# Altium schematic sheet LPCB225 - CONTROLLER.SchDoc
size A3; Address1: Factory 10; Address2: 9-13 Dingley Avenue, Dandeong, VICTORIA 3175, AUSTRALIA; DocumentNumber: 3; Revision: 1; SheetNumber: 3; SheetTotal: 6; Lockie__PCB_SUB_ASSEMBLY: Main Controller; Lockie__PCB_ASSEMBLY: Module; Lockie__LDL: LPCB225; Lockie__PCB_DESCRIPTION: BMS Module
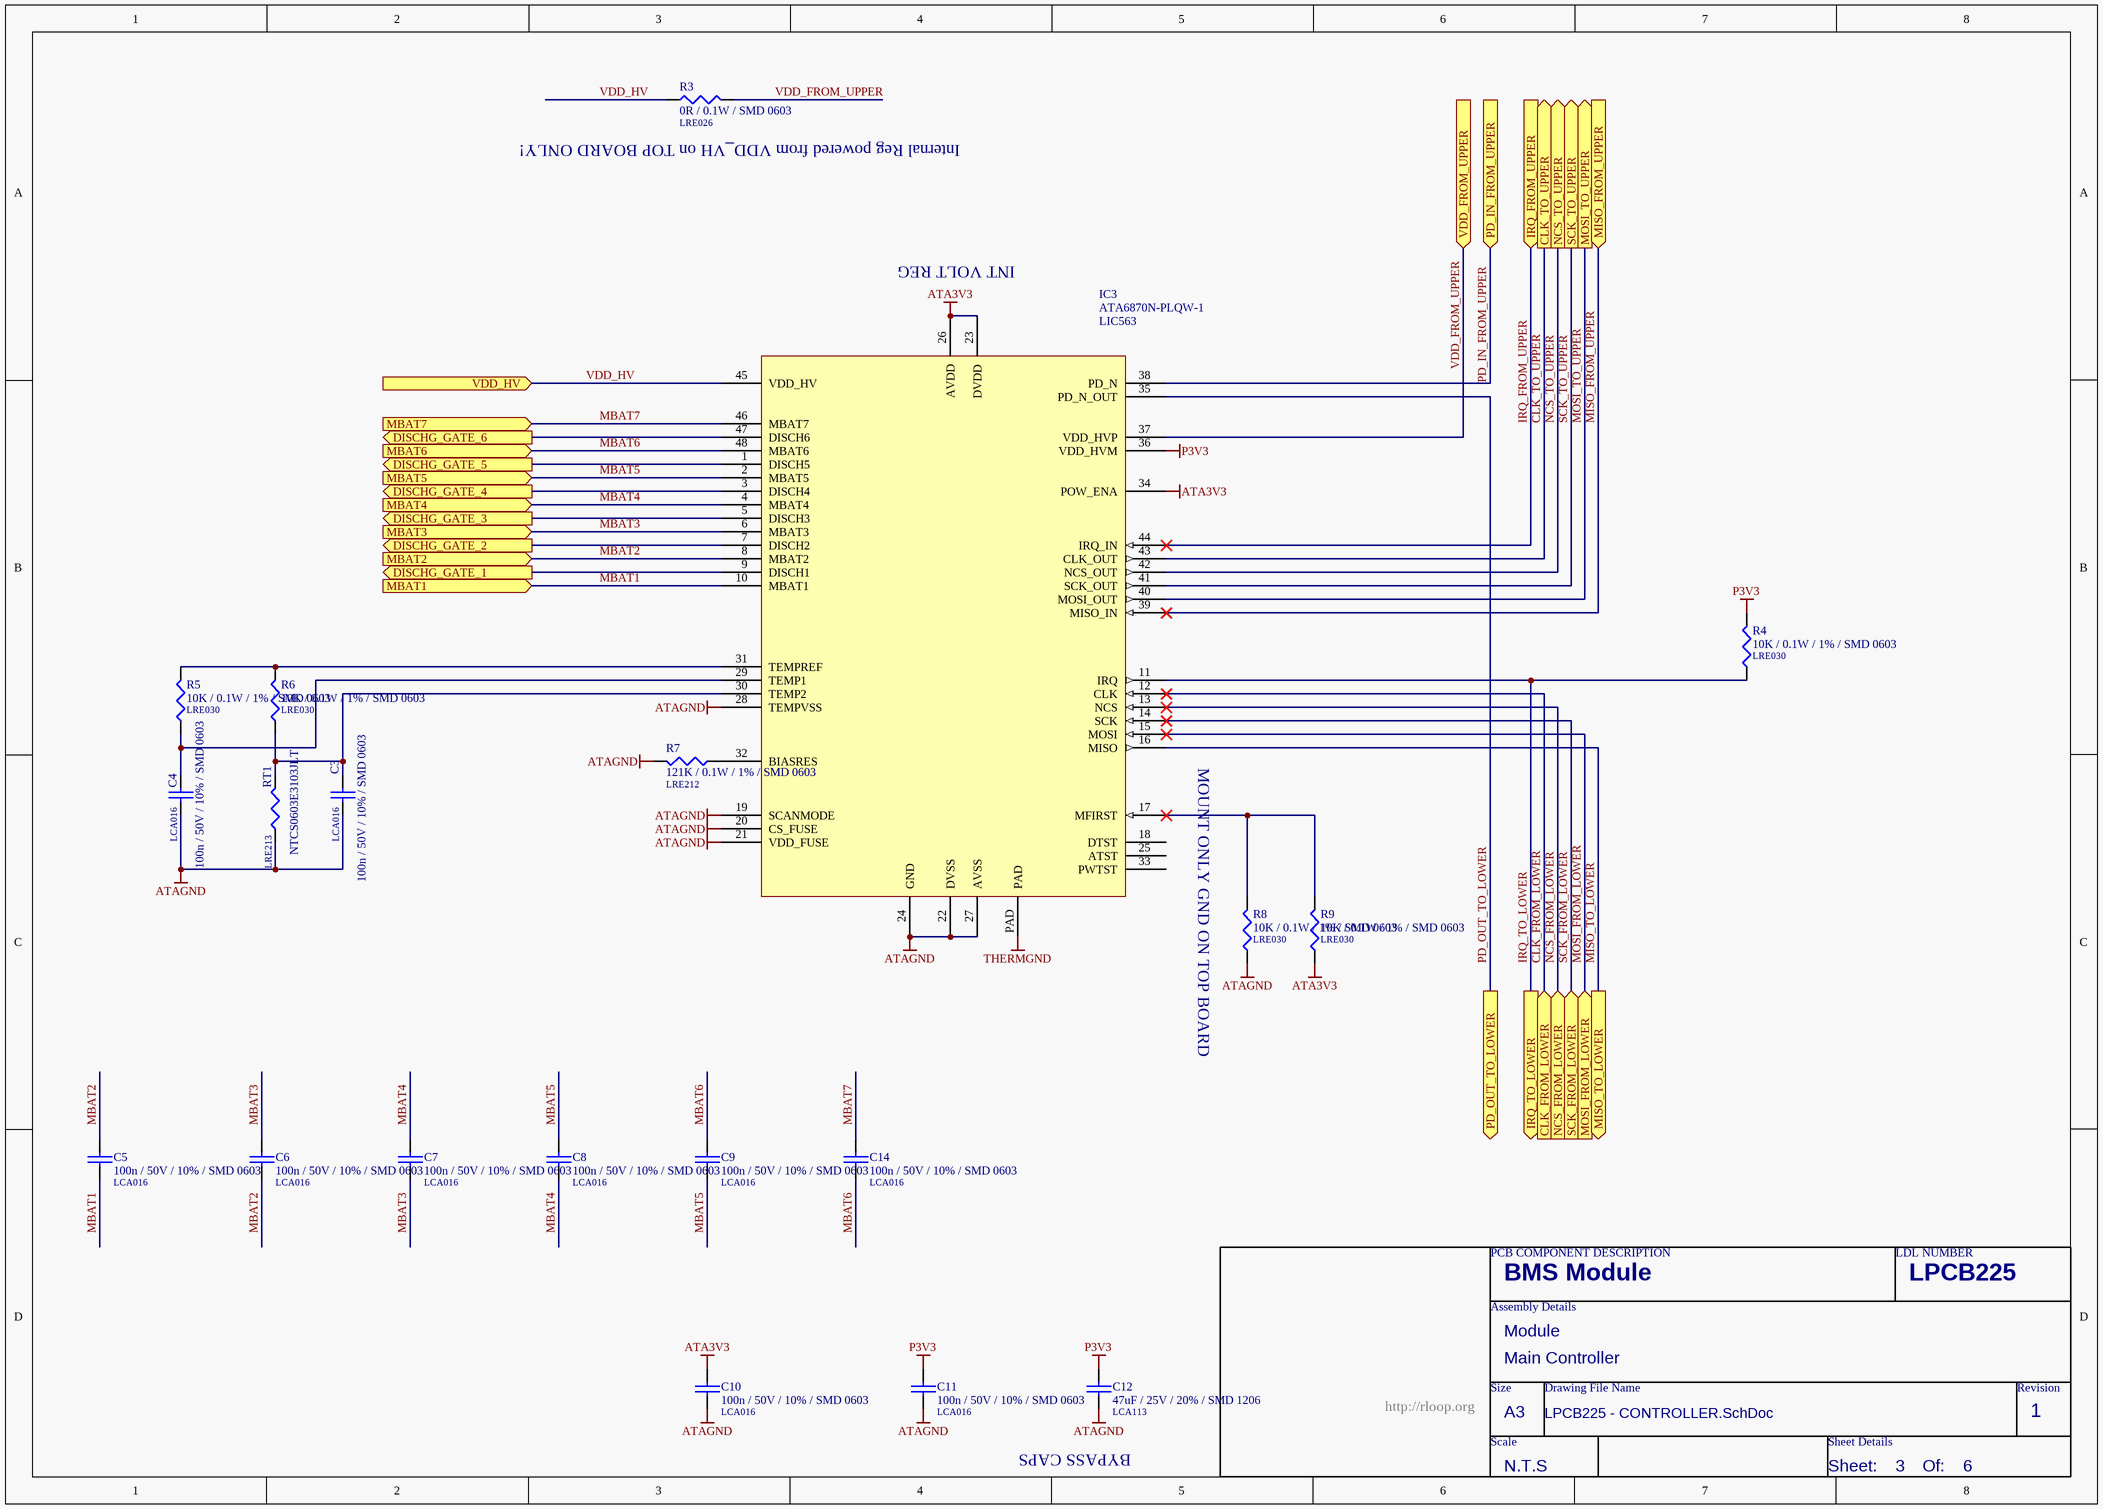
[diagram p0: LPCB225 - CONTROLLER.SchDoc]

## Parts
C3  100n / 50V / 10% / SMD 0603  LDL_NUMBER: LCA016  [LFP011__CC1608-0603-IPC7351_B]
C4  100n / 50V / 10% / SMD 0603  LDL_NUMBER: LCA016  [LFP011__CC1608-0603-IPC7351_B]
C5  100n / 50V / 10% / SMD 0603  LDL_NUMBER: LCA016  [LFP011__CC1608-0603-IPC7351_B]
C6  100n / 50V / 10% / SMD 0603  LDL_NUMBER: LCA016  [LFP011__CC1608-0603-IPC7351_B]
C7  100n / 50V / 10% / SMD 0603  LDL_NUMBER: LCA016  [LFP011__CC1608-0603-IPC7351_B]
C8  100n / 50V / 10% / SMD 0603  LDL_NUMBER: LCA016  [LFP011__CC1608-0603-IPC7351_B]
C9  100n / 50V / 10% / SMD 0603  LDL_NUMBER: LCA016  [LFP011__CC1608-0603-IPC7351_B]
C10  100n / 50V / 10% / SMD 0603  LDL_NUMBER: LCA016  [LFP011__CC1608-0603-IPC7351_B]
C11  100n / 50V / 10% / SMD 0603  LDL_NUMBER: LCA016  [LFP011__CC1608-0603-IPC7351_B]
C12  47uF / 25V / 20% / SMD 1206  LDL_NUMBER: LCA113  [LFP043__CC3216-1206]
C14  100n / 50V / 10% / SMD 0603  LDL_NUMBER: LCA016  [LFP011__CC1608-0603-IPC7351_B]
IC3  ATA6870N-PLQW-1  LDL_NUMBER: LIC563  [LFP136__QFN50P700X700X80_HS-49M]
R3  0R / 0.1W / SMD 0603  LDL_NUMBER: LRE026  [LFP020__CR1608-0603-IPC7351_B]
R4  10K / 0.1W / 1% / SMD 0603  LDL_NUMBER: LRE030  [LFP020__CR1608-0603-IPC7351_B]
R5  10K / 0.1W / 1% / SMD 0603  LDL_NUMBER: LRE030  [LFP020__CR1608-0603-IPC7351_B]
R6  10K / 0.1W / 1% / SMD 0603  LDL_NUMBER: LRE030  [LFP020__CR1608-0603-IPC7351_B]
R7  121K / 0.1W / 1% / SMD 0603  LDL_NUMBER: LRE212  [LFP020__CR1608-0603-IPC7351_B]
R8  10K / 0.1W / 1% / SMD 0603  LDL_NUMBER: LRE030  [LFP020__CR1608-0603-IPC7351_B]
R9  10K / 0.1W / 1% / SMD 0603  LDL_NUMBER: LRE030  [LFP020__CR1608-0603-IPC7351_B]
RT1  NTCS0603E3103JLT  LDL_NUMBER: LRE213  [LFP020__CR1608-0603-IPC7351_B]

## Ports
CLK_FROM_LOWER (in), CLK_TO_UPPER (out), DISCHG_GATE_1 (out), DISCHG_GATE_2 (out), DISCHG_GATE_3 (out), DISCHG_GATE_4 (out), DISCHG_GATE_5 (out), DISCHG_GATE_6 (out), IRQ_FROM_UPPER (in), IRQ_TO_LOWER (out), MBAT1 (in), MBAT2 (in), MBAT3 (in), MBAT4 (in), MBAT5 (in), MBAT6 (in), MBAT7 (in), MISO_FROM_UPPER (in), MISO_TO_LOWER (out), MOSI_FROM_LOWER (in), MOSI_TO_UPPER (out), NCS_FROM_LOWER (in), NCS_TO_UPPER (out), PD_IN_FROM_UPPER (in), PD_OUT_TO_LOWER (out), SCK_FROM_LOWER (in), SCK_TO_UPPER (out), VDD_FROM_UPPER (in), VDD_HV (in)

## Nets
ATA3V3: C10.1 IC3.23(DVDD) IC3.26(AVDD) IC3.34(POW_ENA) R9.1
ATAGND: C3.2 C4.2 C10.2 C11.2 C12.2 IC3.19(SCANMODE) IC3.20(CS_FUSE) IC3.21(VDD_FUSE) IC3.22(DVSS) IC3.24(GND) IC3.27(AVSS) IC3.28(TEMPVSS) R7.2 R8.1 RT1.1
P3V3: C11.1 C12.1 IC3.36(VDD_HVM) R4.2
THERMGND: IC3.PAD
CLK_FROM_LOWER: IC3.12(CLK) ; port CLK_FROM_LOWER
CLK_TO_UPPER: IC3.43(CLK_OUT) ; port CLK_TO_UPPER
DISCHG_GATE_1: IC3.9(DISCH1) ; port DISCHG_GATE_1
DISCHG_GATE_2: IC3.7(DISCH2) ; port DISCHG_GATE_2
DISCHG_GATE_3: IC3.5(DISCH3) ; port DISCHG_GATE_3
DISCHG_GATE_4: IC3.3(DISCH4) ; port DISCHG_GATE_4
DISCHG_GATE_5: IC3.1(DISCH5) ; port DISCHG_GATE_5
DISCHG_GATE_6: IC3.47(DISCH6) ; port DISCHG_GATE_6
IRQ_FROM_UPPER: IC3.44(IRQ_IN) ; port IRQ_FROM_UPPER
IRQ_TO_LOWER: IC3.11(IRQ) R4.1 ; port IRQ_TO_LOWER
MBAT1: C5.2 IC3.10(MBAT1) ; port MBAT1
MBAT2: C5.1 C6.2 IC3.8(MBAT2) ; port MBAT2
MBAT3: C6.1 C7.2 IC3.6(MBAT3) ; port MBAT3
MBAT4: C7.1 C8.2 IC3.4(MBAT4) ; port MBAT4
MBAT5: C8.1 C9.2 IC3.2(MBAT5) ; port MBAT5
MBAT6: C9.1 C14.2 IC3.48(MBAT6) ; port MBAT6
MBAT7: C14.1 IC3.46(MBAT7) ; port MBAT7
MISO_FROM_UPPER: IC3.39(MISO_IN) ; port MISO_FROM_UPPER
MISO_TO_LOWER: IC3.16(MISO) ; port MISO_TO_LOWER
MOSI_FROM_LOWER: IC3.15(MOSI) ; port MOSI_FROM_LOWER
MOSI_TO_UPPER: IC3.40(MOSI_OUT) ; port MOSI_TO_UPPER
NCS_FROM_LOWER: IC3.13(NCS) ; port NCS_FROM_LOWER
NCS_TO_UPPER: IC3.42(NCS_OUT) ; port NCS_TO_UPPER
PD_IN_FROM_UPPER: IC3.38(PD_N) ; port PD_IN_FROM_UPPER
PD_OUT_TO_LOWER: IC3.35(PD_N_OUT) ; port PD_OUT_TO_LOWER
SCK_FROM_LOWER: IC3.14(SCK) ; port SCK_FROM_LOWER
SCK_TO_UPPER: IC3.41(SCK_OUT) ; port SCK_TO_UPPER
VDD_FROM_UPPER: IC3.37(VDD_HVP) R3.2 ; port VDD_FROM_UPPER
VDD_HV: IC3.45(VDD_HV) R3.1 ; port VDD_HV
NetC3_1: C3.1 IC3.30(TEMP2) R6.1 RT1.2
NetC4_1: C4.1 IC3.29(TEMP1) R5.1
NetIC3_17: IC3.17(MFIRST) R8.2 R9.2
NetIC3_31: IC3.31(TEMPREF) R5.2 R6.2
NetIC3_32: IC3.32(BIASRES) R7.1

Not connected (* = marked no-connect by the designer): IC3 18(DTST) 25(ATST) 33(PWTST)

## Notes on the sheet
- (near R3) Internal Reg powered from VDD_VH on TOP BOARD ONLY!
- INT VOLT REG
- (near R8) MOUNT ONLY GND ON TOP BOARD
- BYPASS CAPS
- PCB COMPONENT DESCRIPTION
- LDL NUMBER
- Assembly Details
- Size
- Drawing File Name
- Revision
- http://rloop.org
- Scale
- A3
- Sheet Details
- N.T.S
- Sheet:
- Of:

## Library data of the parts
C3-C11 C14 = 100n / 50V / 10% / SMD 0603: Capacitor, Ceramic Chip, 100nF (0.1uF), 50V, 5%, SMD 0603 [LCA016]; FMEDA__OPERATING__VOLTAGE_MIN: 0; FMEDA__OPERATING__VOLTAGE_MAX: 3.3; FMEDA__OPERATING__TEMP_MIN: -20; FMEDA__OPERATING__TEMP_TYP: 27; FMEDA__OPERATING__TEMP_MAX: 50; FMEDA__CHANNEL: COM; Value: 100n; FMEDA__FUNCTION_IN_SYSTEM: *; FMEDA__OPERATING__VOLTAGE_TYP: 3.3
C12 = 47uF / 25V / 20% / SMD 1206: Capacitor, Ceramic Chip, 47uF, 25V, 20%, SMD 1206 [LCA113]; Value: 47u; FMEDA__OPERATING__TEMP_MAX: 50; FMEDA__OPERATING__TEMP_MIN: -20; FMEDA__OPERATING__TEMP_TYP: 27; FMEDA__OPERATING__VOLTAGE_MAX: 3.3; FMEDA__OPERATING__VOLTAGE_MIN: 0; FMEDA__CHANNEL: COM; FMEDA__FUNCTION_IN_SYSTEM: *; FMEDA__OPERATING__VOLTAGE_TYP: 3.3
R3 = 0R / 0.1W / SMD 0603: Resistor, Ceramic Chip, 0R, 0.1W, SMD 0603 [LRE026]; Value: 0; FMEDA__OPERATING__TEMP_MAX: 50; FMEDA__OPERATING__TEMP_MIN: -20; FMEDA__OPERATING__TEMP_TYP: 27; FMEDA__CHANNEL: COM; FMEDA__OPERATING__POWER_MAX: 0; FMEDA__OPERATING__POWER_MIN: 0; FMEDA__OPERATING__VOLTAGE_MAX: 0; FMEDA__OPERATING__VOLTAGE_MIN: 0; FMEDA__OPERATING__VOLTAGE_TYP: 0; FMEDA__FUNCTION_IN_SYSTEM: *
R4-R6 R8 R9 = 10K / 0.1W / 1% / SMD 0603: Resistor, Ceramic Chip, 10K, 0.1W, 1%, SMD 0603 [LRE030]; FMEDA__OPERATING__POWER_MAX: 0; FMEDA__OPERATING__TEMP_MAX: 50; FMEDA__OPERATING__TEMP_MIN: -20; FMEDA__OPERATING__TEMP_TYP: 27; FMEDA__CHANNEL: COM; Value: 10K; FMEDA__OPERATING__POWER_MIN: 0; FMEDA__OPERATING__VOLTAGE_MAX: 0; FMEDA__OPERATING__VOLTAGE_MIN: 0; FMEDA__OPERATING__VOLTAGE_TYP: 0; FMEDA__FUNCTION_IN_SYSTEM: *
R7 = 121K / 0.1W / 1% / SMD 0603: Resistor, Ceramic Chip, 121K, 0.1W, SMD 0603 [LRE212]; FMEDA__OPERATING__POWER_MAX: 0; FMEDA__OPERATING__TEMP_MAX: 50; FMEDA__OPERATING__TEMP_MIN: -20; FMEDA__OPERATING__TEMP_TYP: 27; FMEDA__CHANNEL: COM; Value: 121K; FMEDA__OPERATING__POWER_MIN: 0; FMEDA__OPERATING__VOLTAGE_MAX: 0; FMEDA__OPERATING__VOLTAGE_MIN: 0; FMEDA__OPERATING__VOLTAGE_TYP: 0; FMEDA__FUNCTION_IN_SYSTEM: *
RT1 = NTCS0603E3103JLT: Thermistor, 10K, 5%, SMD 0603 [LRE213]; FMEDA__OPERATING__POWER_MAX: 0.01; FMEDA__OPERATING__POWER_MIN: 0; FMEDA__OPERATING__TEMP_MAX: 50; FMEDA__OPERATING__TEMP_MIN: -20; FMEDA__OPERATING__TEMP_TYP: 27; FMEDA__CHANNEL: COM; Value: 10K; FMEDA__OPERATING__VOLTAGE_MAX: 0; FMEDA__OPERATING__VOLTAGE_MIN: 0; FMEDA__OPERATING__VOLTAGE_TYP: 0; FMEDA__FUNCTION_IN_SYSTEM: *